# EAGLE design Pithy Pixel (EAGLE 9.6.2)
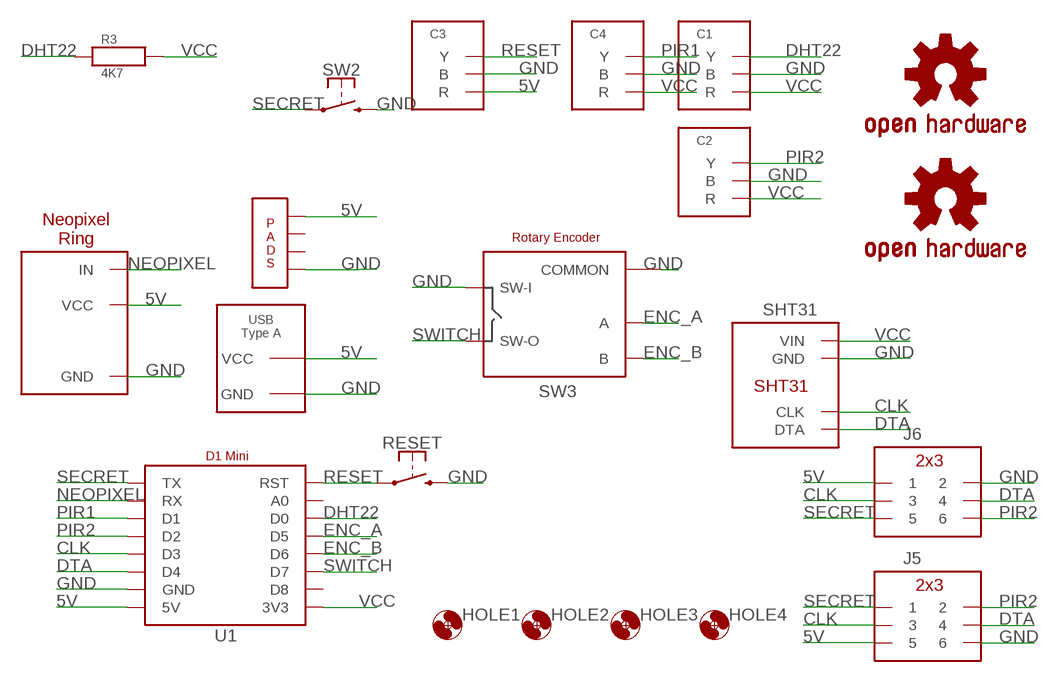
[diagram p0: schematic, sheet 1]

## Parts
C1  JST_2MM_3PIN  [JST_2MM_3PIN]
C2  JST_2MM_3PIN  [JST_2MM_3PIN]
C3  JST_2MM_3PIN  [JST_2MM_3PIN]
C4  JST_2MM_3PIN  [JST_2MM_3PIN]
HOLE1  HOLE_3.2  [HOLE_3.2]
HOLE2  HOLE_3.2  [HOLE_3.2]
HOLE3  HOLE_3.2  [HOLE_3.2]
HOLE4  HOLE_3.2  [HOLE_3.2]
IC1  NEOPIXEL_RING_NO_OUT  [NEOPIXEL_RING_SMALL_NO_OUT]
J5  DIL_2X03FEMALE  [2X3-RAF]
J6  DIL_2X03FEMALE  [2X3-RAF]
LOGO1  OSHW-LOGOM  [OSHW-LOGO-M]
LOGO2  OSHW-LOGOS  [OSHW-LOGO-S]
R3  4K7  1/4W_RESISTOR  [1/4W_RESISTOR]
RESET  SPDT_MOMENTARY  [SPDT_RIGHT_ANGLE]
SHT31  SHT31RIGHT_ANGLED  [SHT31_RIGHT_ANGLE]
SW2  SPDT_MOMENTARY  [SPDT_RIGHT_ANGLE]
SW3  ENCODER  ROTARY_ENCODER  [ROTARY_ENCODER]
U1  D1_MINI  [D1_MINI]
U$1  USB_TYPE_A  [USB_TYPE_A_BACKWARDS]
U$2  PADS_4  [PADS_4]

## Nets
5V [power]: C3.RED(R) IC1.VCC@1(VCC) J5.5 J6.1 U1.5V U$1.VCC U$2.P$4
CLK: J5.3 J6.3 SHT31.CLK U1.D3
DHT22: C1.YELLOW(Y) R3.P$1 U1.D0
DTA: J5.4 J6.4 SHT31.DTA U1.D4
ENC_A: SW3.A U1.D5
ENC_B: SW3.B U1.D6
GND: C1.BLACK(B) C2.BLACK(B) C3.BLACK(B) C4.BLACK(B) IC1.GND@2(GND) J5.6 J6.2 RESET.2 SHT31.GND SW2.2 SW3.C(COMMON) SW3.SW+(SW-I) U1.GND U$1.GND U$2.P$1
NEOPIXEL: IC1.IN U1.RX
PIR1: C4.YELLOW(Y) U1.D1
PIR2: C2.YELLOW(Y) J5.2 J6.6 U1.D2
RESET: C3.YELLOW(Y) RESET.1 U1.RST
SECRET: J5.1 J6.5 SW2.1 U1.TX
SWITCH: SW3.SW-(SW-O) U1.D7
VCC [comms]: C1.RED(R) C2.RED(R) C4.RED(R) R3.P$2 SHT31.VIN U1.3V3
Unconnected: U1.A0 U1.D8 U$2.P$2 U$2.P$3

## Library data of the parts
C1-C4 = ioios:JST_2MM_3PIN
HOLE1-HOLE4 = ioios:HOLE_3.2
IC1 = ioios:NEOPIXEL_RING_NO_OUT
J5 J6 = ioios:DIL_2X03
LOGO1 LOGO2 = ioios:OSHW-LOGO: Open-Source Hardware (OSHW) Logo This logo indicates the piece of hardware it is found on incorporates a OSHW license and/or adheres to the definition of open source hardware found here: http://freedomdefined.org/OSHW
R3 = ioios:1/4W_RESISTOR
RESET SW2 = ioios:SPDT_MOMENTARY
SHT31 = ioios:SHT31
SW3 = ioios:ROTARY_ENCODER
U1 = ioios:D1_MINI
U$1 = ioios:USB_TYPE_A
U$2 = ioios:PADS_4

## Net classes
0 default: clearance 0.205 mm
1 power: width 0.203 mm, clearance 0.254 mm
2 comms: width 0.203 mm, clearance 0.203 mm

## Board
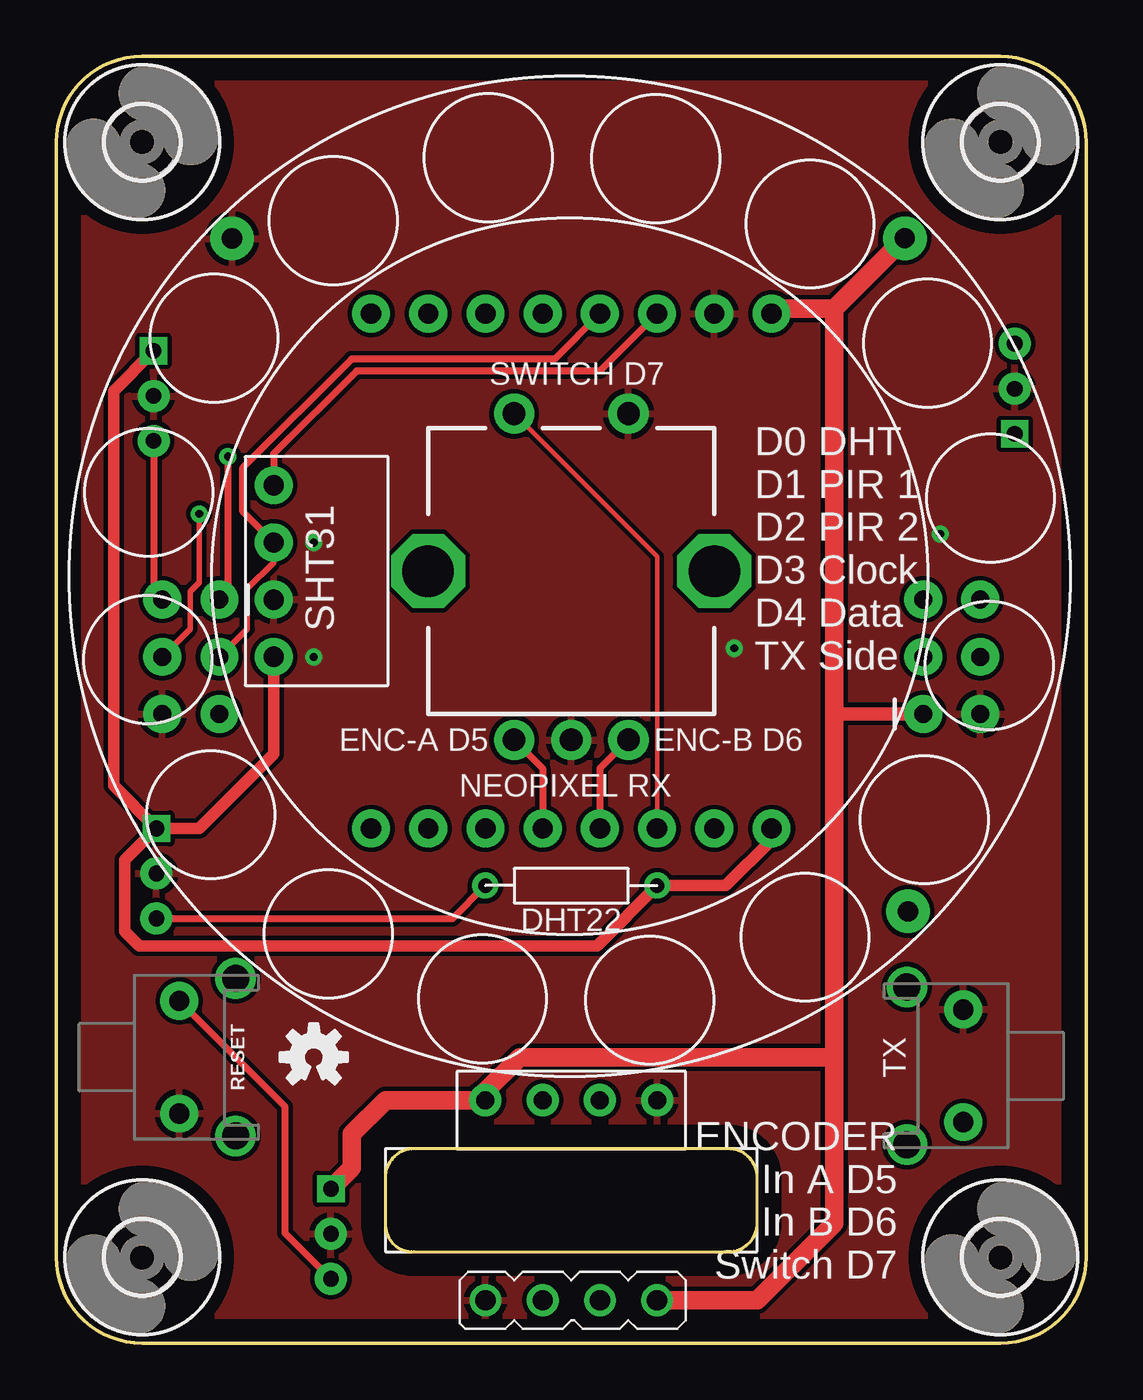
[diagram p1: board, top side]
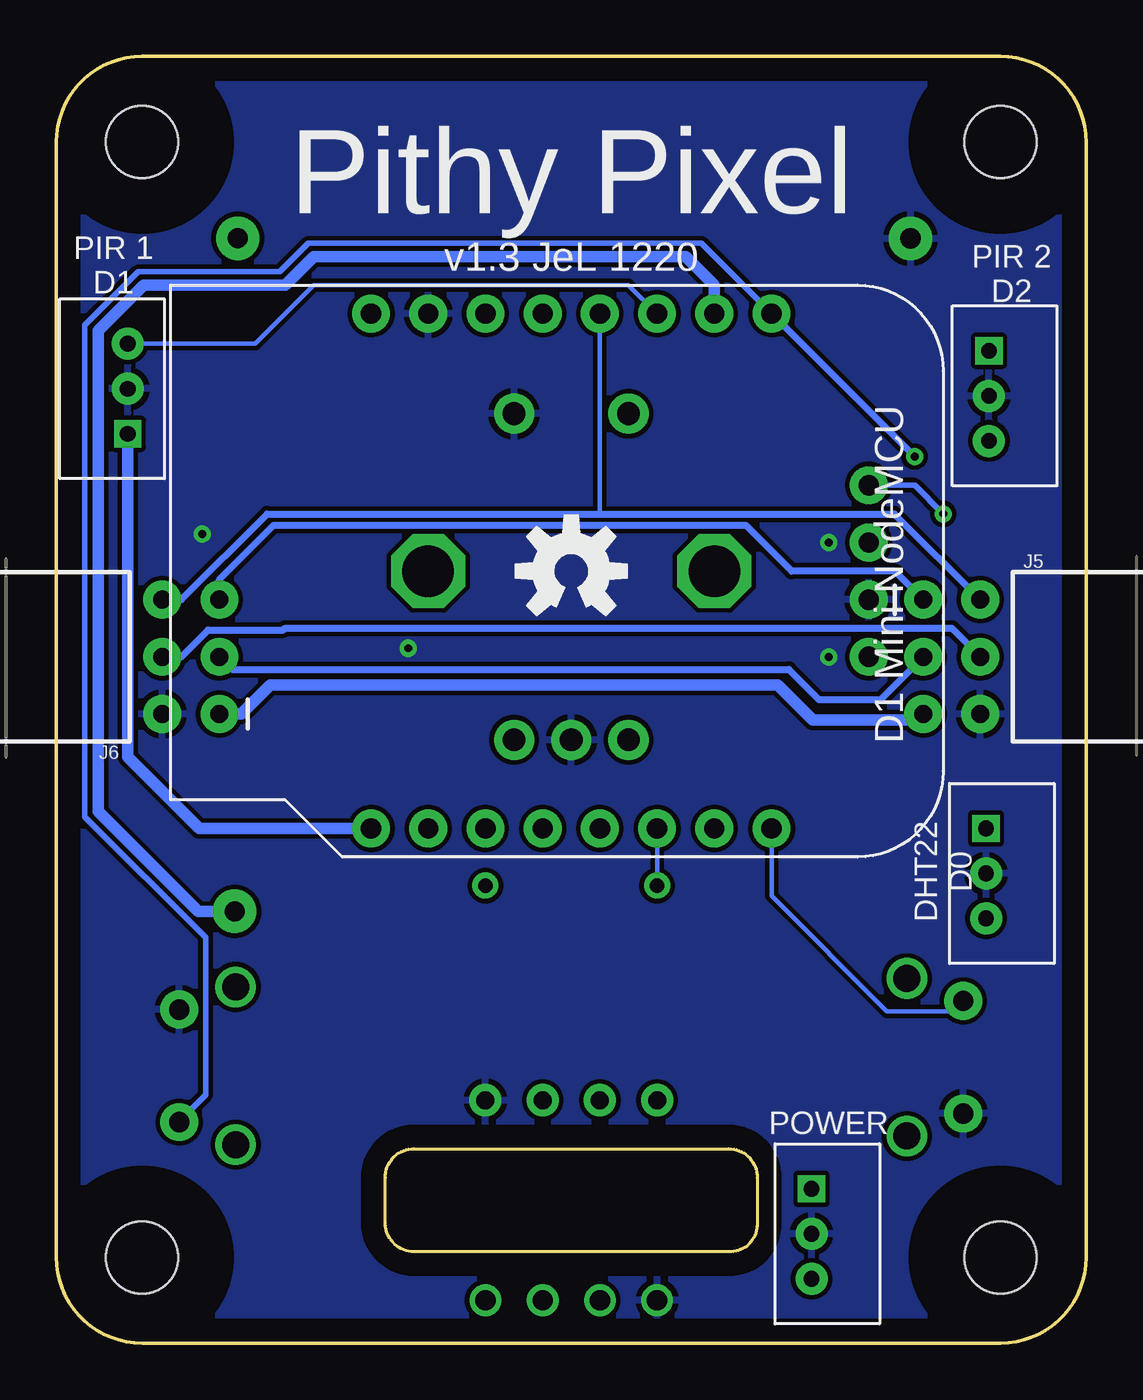
[diagram p2: board, bottom side, seen from below]

Size 45.72 x 57.15 mm. Coordinates in mm from the lower left corner, seen from the top.
Outline: 0,3.81 arc90 3.81,0 41.91,0 arc90 45.72,3.81 45.72,53.34 arc90 41.91,57.15 3.81,57.15 arc90 0,53.34 0,3.81
Copper layers (1*16): Top 0.035mm / dielectric 0.98mm / Bottom 0.035mm
Design rules "default *": minimum track width 6mil, minimum drill 0.35mm, track to track 6mil, track to pad 6mil, pad to pad 6mil, via to via 6mil, smd to smd 6mil, copper to edge 40mil, drill to drill 6mil, minimum pad ring 10mil, minimum via ring 8mil, stop-mask expansion 4mil, vias tented up to drill 0mil, thermal gap 10mil

### Footprints (pad centres in the part's own frame; a part is rotated, then mirrored left to right if it is on the bottom)
JST_2MM_3PIN = drill 0.7 pad 1.422: BLACK 2,-0.508; YELLOW 4,-0.508 | drill 0.7 square: RED 0,-0.508
HOLE_3.2 = hole 3.2: 0,0
NEOPIXEL_RING_SMALL_NO_OUT = drill 0.9 pad 1.93: GND@2 -11.557,-20.32; IN 11.43,15.24; VCC@1 -17.78,8.89
2X3-RAF = drill 0.8 pad 1.676: 1 -1.27,5.08; 2 1.27,5.08; 3 -1.27,2.54; 4 1.27,2.54; 5 -1.27,0; 6 1.27,0
1/4W_RESISTOR = drill 0.65: P$1 -3.81,0; P$2 3.81,0
SPDT_RIGHT_ANGLE = drill 0.9 pad 1.676: 1 -2.5,0; 2 2.5,0 | drill 1.2 pad 1.676: ANCHOR1 -3.5,2.5; ANCHOR2 3.5,2.5
SHT31_RIGHT_ANGLE = drill 0.9 pad 1.676: CLK 5.08,0; DTA 7.62,0; GND 2.54,0; VIN 0,0
ROTARY_ENCODER = drill 1.016 pad 1.778: A 7.493,-2.54; B 7.493,2.54; C 7.493,0; SW+ -6.985,2.54; SW- -6.985,-2.54 | drill 2.286 octagon: ANC1 0,6.35; ANC2 0,-6.35
D1_MINI = drill 0.9 pad 1.676: 3V3 24.13,8.89; 5V 1.27,8.89; A0 24.13,24.13; D0 24.13,21.59; D1 1.27,21.59; D2 1.27,19.05; D3 1.27,16.51; D4 1.27,13.97; D5 24.13,19.05; D6 24.13,16.51; D7 24.13,13.97; D8 24.13,11.43; GND 1.27,11.43; RST 24.13,26.67; RX 1.27,24.13; TX 1.27,26.67
USB_TYPE_A_BACKWARDS = drill 0.8 pad 1.422: GND 7.62,0; P$2 2.54,0; P$3 5.08,0; VCC 0,0
PADS_4 = drill 0.9: P$1 0,0; P$2 2.54,0; P$3 5.08,0; P$4 7.62,0

### Placement (x,y rotation side)
C1  3.94,22.86 270 bottom
C2  3.81,44.07 270 bottom
C3  11.68,6.86 270 bottom
C4  43.05,40.39 90 bottom
HOLE1  3.81,3.81 0 top
HOLE2  3.81,53.34 0 top
HOLE3  41.91,53.34 0 top
HOLE4  41.91,3.81 0 top
IC1  25.27,33.53 258 top
J5  5.97,27.94 0 bottom
J6  39.75,33.02 180 bottom
LOGO1  22.86,34.29 0 bottom
LOGO2  11.43,12.7 0 top
R3  22.86,20.32 0 top
RESET  5.46,12.7 270 top
SHT31  9.65,30.48 90 top
SW2  40.26,12.32 90 top
SW3  22.86,34.29 270 top
U1  40.64,46.99 270 bottom
U$1  19.05,10.79 0 top
U$2  19.05,1.91 0 top

### Tracks (layer width: path | path; a pad name or v marks a point on that pad's centre or on a via)
5V
  Top 0.61: J6.1 34.54,27.94
  Top 0.813: U$2.P$4 31.11,1.91 34.54,5.33 34.54,12.7 | 34.54,12.7 20.57,12.7 19.05,11.18 U$1.VCC 14.62,10.79 13.12,9.29 13.12,7.79 C3.RED | IC1.VCC@1 34.54,45.95 | 34.54,45.95 34.54,27.94 34.54,12.7 | U1.5V 31.98,45.95 34.54,45.95
  Bottom 0.508: J5.5 7.49,27.69 12.14,27.69 13.69,29.23 36.22,29.23 37.52,27.94 J6.1
CLK
  Top 0.254: J5.3 8.48,31.72 8.48,33.51 9.65,34.67 SHT31.CLK
  Top 0.305: U1.D3 22.12,43.71 13.11,43.71 8.26,38.86 8.26,36.96 SHT31.CLK
  Bottom 0.305: J5.3 9.14,28.57 11.86,28.57 13.2,29.92 37.92,29.92 J6.3
DHT22
  Top 0.305: C1.YELLOW 17.59,18.86 R3.P$1
  Bottom 0.2: R3.P$1 U1.D0
DTA  (via drill 0.35)
  Top 0.254: v6.35,36.83 6.35,33.79 5.94,33.38 5.94,31.72 J5.4
  Top 0.305: U1.D4 24.13,43.18 13.34,43.18 9.65,39.5 SHT31.DTA
  Bottom 0.254: v6.35,36.83 7.62,38.1 SHT31.DTA
  Bottom 0.305: J6.4 40.17,30.48 38.98,31.68 35.63,31.68 35.56,31.75 5.97,31.75 J5.4
ENC_A
  Top 0.305: SW3.A 21.59,25.53 U1.D5
ENC_B
  Top 0.305: SW3.B 24.13,25.53 U1.D6
GND  (via drill 0.35)
  other vias: 39.24,35.94 11.43,30.48 30.1,30.86 11.43,35.56
  pour Top: 0,0 0,57.15 45.72,57.15 45.72,0
  pour Bottom: 0,0 0,57.15 45.72,57.15 45.72,0
NEOPIXEL
  Bottom 0.508: IC1.IN 39.42,19.18 43.87,23.62 43.87,44.96 41.83,46.99 35.56,46.99 34.29,48.26 17.78,48.26 16.51,46.99 U1.RX
PIR1
  Bottom 0.2: C4.YELLOW 36.89,44.39 34.29,46.99 20.32,46.99 U1.D1
PIR2
  Top 0.305: C2.YELLOW 4.32,33.4 J5.2
  Bottom 0.2: U1.D2 21.59,36.83
  Bottom 0.305: J6.6 40.17,33.02 36.36,36.83 21.59,36.83 8.51,36.83 J5.2
RESET
  Top 0.305: C3.YELLOW 10.16,4.89 10.16,10.5 RESET.1
  Bottom 0.2: U1.RST 13.97,19.85 8.86,14.74 5.92,14.74 RESET.1
SECRET  (via drill 0.35)
  Top 0.305: v7.62,39.37 7.62,33.4 J5.1
  Bottom 0.254: SW2.1 40.26,9.86 39.09,11.03 39.09,18.02 44.45,23.38 44.45,45.2 42.08,47.58 35.8,47.58 34.53,48.85 17.1,48.85 U1.TX
  Bottom 0.305: J5.1 8.51,34.29 13.08,34.29 15.11,36.32 36.07,36.32 38.48,33.91 J6.5 | U1.TX v7.62,39.37
  other vias: 7.24,33.02
SWITCH
  Top 0.2: SW3.SW- 26.67,34.92 U1.D7
VCC
  Top 0.305: U1.3V3 31.75,22.35
  Top 0.508: 31.75,22.35 29.72,20.32 R3.P$2 24,17.65 3.68,17.65 3.05,18.29 3.05,21.46 C1.RED | C1.RED 6.35,22.86 9.65,26.16 SHT31.VIN | C1.RED 2.54,24.77 2.54,42.29 C2.RED
  Bottom 0.508: C4.RED 42.55,26.04 39.37,22.86 U1.3V3

### Text on the board
bPlace: Pithy Pixel | v1.3 JeL 1220
tNames: SWITCH D7 | D0 DHT / D1 PIR 1 / D2 PIR 2 / D3 Clock / D4 Data / TX Side | ENC-A D5 | ENC-B D6 | NEOPIXEL RX | DHT22 | TX | ENCODER / In A D5 / In B D6 / Switch D7
bNames: PIR 1 / D1 | PIR 2 / D2 | DHT22 / D0 | POWER